# EAGLE design CMWC-Product (EAGLE 9.6.2)
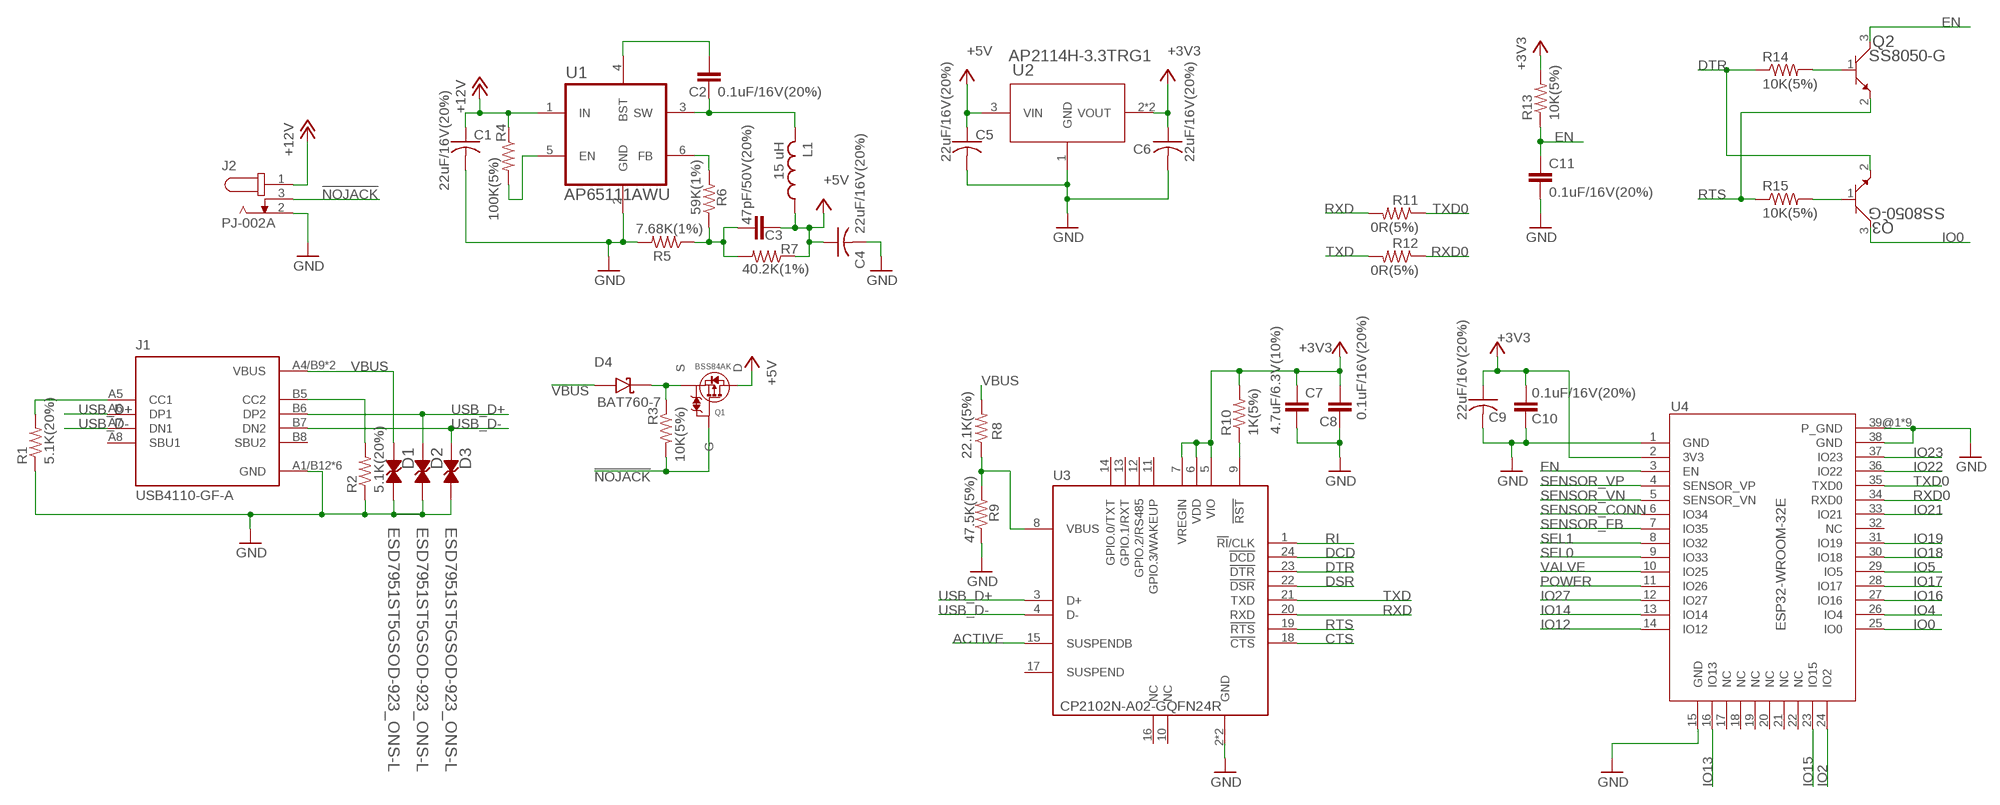
[diagram p0: schematic, sheet 1, part 1 of 2]
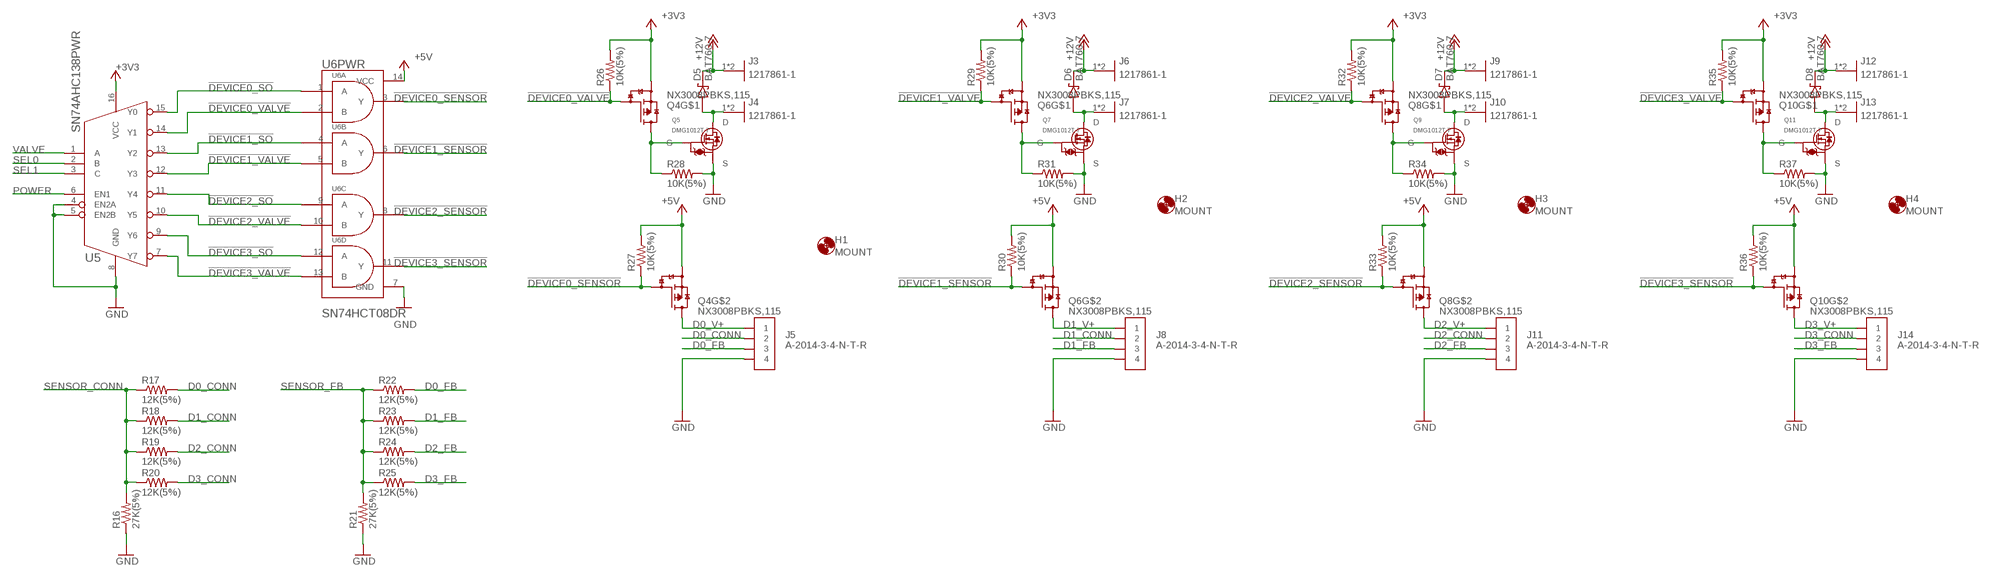
[diagram p1: schematic, sheet 1, part 2 of 2]

## Parts
C1  22uF/16V(20%)  C-USC1206  [C1206]
C2  0.1uF/16V(20%)  C-EUC0603  [C0603]
C3  47pF/50V(20%)  C-EUC0603  [C0603]
C4  22uF/16V(20%)  C-USC1206  [C1206]
C5  22uF/16V(20%)  C-USC1206  [C1206]
C6  22uF/16V(20%)  C-USC1206  [C1206]
C7  4.7uF/6.3V(10%)  C-EUC0603  [C0603]
C8  0.1uF/16V(20%)  C-EUC0603  [C0603]
C9  22uF/16V(20%)  C-USC1206  [C1206]
C10  0.1uF/16V(20%)  C-EUC0603  [C0603]
C11  0.1uF/16V(20%)  C-EUC0603  [C0603]
D1  ESD7951ST5GSOD-923_ONS-L  [SOD-923_ONS-L]
D2  ESD7951ST5GSOD-923_ONS-L  [SOD-923_ONS-L]
D3  ESD7951ST5GSOD-923_ONS-L  [SOD-923_ONS-L]
D4  BAT760-7  [SOD2513X120N]
D5  BAT760-7  [SOD2513X120N]
D6  BAT760-7  [SOD2513X120N]
D7  BAT760-7  [SOD2513X120N]
D8  BAT760-7  [SOD2513X120N]
H1  MOUNT  [#6-MOUNT]
H2  MOUNT  [#6-MOUNT]
H3  MOUNT  [#6-MOUNT]
H4  MOUNT  [#6-MOUNT]
J1  USB4110-GF-A  [GCT_USB4110-GF-A]
J2  PJ-002A  [CUI_PJ-002A]
J3  1217861-1  [TE_1217861-1]
J4  1217861-1  [TE_1217861-1]
J5  A-2014-3-4-N-T-R  [A-2014-3-4-N-T-R]
J6  1217861-1  [TE_1217861-1]
J7  1217861-1  [TE_1217861-1]
J8  A-2014-3-4-N-T-R  [A-2014-3-4-N-T-R]
J9  1217861-1  [TE_1217861-1]
J10  1217861-1  [TE_1217861-1]
J11  A-2014-3-4-N-T-R  [A-2014-3-4-N-T-R]
J12  1217861-1  [TE_1217861-1]
J13  1217861-1  [TE_1217861-1]
J14  A-2014-3-4-N-T-R  [A-2014-3-4-N-T-R]
L1  15 uH  BWVS00505040150M00  [BWVS00505040]
Q1  BSS84AK  [TO236]
Q2  SS8050-G  [TRAN_SS8050-G_CIP]
Q3  SS8050-G  [TRAN_SS8050-G_CIP]
Q4  NX3008PBKS,115  [SOT65P210X110-6N]
Q5  DMG1012T-7  [SOT523]
Q6  NX3008PBKS,115  [SOT65P210X110-6N]
Q7  DMG1012T-7  [SOT523]
Q8  NX3008PBKS,115  [SOT65P210X110-6N]
Q9  DMG1012T-7  [SOT523]
Q10  NX3008PBKS,115  [SOT65P210X110-6N]
Q11  DMG1012T-7  [SOT523]
R1  5.1K(20%)  R-US_R0603  [R0603]
R2  5.1K(20%)  R-US_R0603  [R0603]
R3  10K(5%)  R-US_R0603  [R0603]
R4  100K(5%)  R-US_R0603  [R0603]
R5  7.68K(1%)  R-US_R0603  [R0603]
R6  59K(1%)  R-US_R0603  [R0603]
R7  40.2K(1%)  R-US_R0603  [R0603]
R8  22.1K(5%)  R-US_R0603  [R0603]
R9  47.5K(5%)  R-US_R0603  [R0603]
R10  1K(5%)  R-US_R0603  [R0603]
R11  0R(5%)  R-US_R0603  [R0603]
R12  0R(5%)  R-US_R0603  [R0603]
R13  10K(5%)  R-US_R0603  [R0603]
R14  10K(5%)  R-US_R0603  [R0603]
R15  10K(5%)  R-US_R0603  [R0603]
R16  27K(5%)  R-US_R0603  [R0603]
R17  12K(5%)  R-US_R0603  [R0603]
R18  12K(5%)  R-US_R0603  [R0603]
R19  12K(5%)  R-US_R0603  [R0603]
R20  12K(5%)  R-US_R0603  [R0603]
R21  27K(5%)  R-US_R0603  [R0603]
R22  12K(5%)  R-US_R0603  [R0603]
R23  12K(5%)  R-US_R0603  [R0603]
R24  12K(5%)  R-US_R0603  [R0603]
R25  12K(5%)  R-US_R0603  [R0603]
R26  10K(5%)  R-US_R0603  [R0603]
R27  10K(5%)  R-US_R0603  [R0603]
R28  10K(5%)  R-US_R0603  [R0603]
R29  10K(5%)  R-US_R0603  [R0603]
R30  10K(5%)  R-US_R0603  [R0603]
R31  10K(5%)  R-US_R0603  [R0603]
R32  10K(5%)  R-US_R0603  [R0603]
R33  10K(5%)  R-US_R0603  [R0603]
R34  10K(5%)  R-US_R0603  [R0603]
R35  10K(5%)  R-US_R0603  [R0603]
R36  10K(5%)  R-US_R0603  [R0603]
R37  10K(5%)  R-US_R0603  [R0603]
U1  AP65111AWU  AP65111AWU-7  [SOT95P280X100-6N]
U2  AP2114H-3.3TRG1  [SOT-223_DIO]
U3  CP2102N-A02-GQFN24R  [QFN50P400X400X80-25N]
U4  ESP32-WROOM-32E  [ESP32-WROOM-32E]
U5  SN74AHC138PWR  [SOP65P640X120-16N]
U6  SN74HCT08DR  [SOIC127P600X175-14N]

## Nets
!DEVICE0_SENSOR: Q4.5(G2) R27.1 U6.3(A:Y)
!DEVICE0_SO: U5.15(Y0) U6.1(A:A)
!DEVICE0_VALVE: Q4.2(G1) R26.1 U5.14(Y1) U6.2(A:B)
!DEVICE1_SENSOR: Q6.5(G2) R30.1 U6.6(B:Y)
!DEVICE1_SO: U5.13(Y2) U6.4(B:A)
!DEVICE1_VALVE: Q6.2(G1) R29.1 U5.12(Y3) U6.5(B:B)
!DEVICE2_SENSOR: Q8.5(G2) R33.1 U6.8(C:Y)
!DEVICE2_SO: U5.11(Y4) U6.9(C:A)
!DEVICE2_VALVE: Q8.2(G1) R32.1 U5.10(Y5) U6.10(C:B)
!DEVICE3_SENSOR: Q10.5(G2) R36.1 U6.11(D:Y)
!DEVICE3_SO: U5.9(Y6) U6.12(D:A)
!DEVICE3_VALVE: Q10.2(G1) R35.1 U5.7(Y7) U6.13(D:B)
!NOJACK: J2.3 Q1.G R3.2
+3V3: C6.1 C7.1 C8.1 C9.1 C10.1 Q4.1(S1) Q6.1(S1) Q8.1(S1) Q10.1(S1) R10.2 R13.2 R26.2 R29.2 R32.2 R35.2 U2.2(VOUT) U2.4(VOUT) U3.5(VIO) U3.6(VDD) U3.7(VREGIN) U4.2(3V3) U5.16(VCC)
+5V: C3.2 C4.1 C5.1 L1.P$1 Q1.D Q4.4(S2) Q6.4(S2) Q8.4(S2) Q10.4(S2) R7.1 R27.2 R30.2 R33.2 R36.2 U2.3(VIN) U6.14(PWR:VCC)
+12V: C1.1 D5.C D6.C D7.C D8.C J2.1 J3.1 J3.2 J6.1 J6.2 J9.1 J9.2 J12.1 J12.2 R4.1 U1.1(IN)
ACTIVE: U3.15(SUSPENDB)
BUCK_BST: C2.1 U1.4(BST)
BUCK_EN: R4.2 U1.5(EN)
BUCK_FB: R6.2 U1.6(FB)
BUCK_SW: C2.2 L1.P$2 U1.3(SW)
CTS: U3.18(!CTS)
D0_CONN: J5.2 R17.2
D0_FB: J5.3 R22.2
D0_V+: J5.1 Q4.3(D2)
D1_CONN: J8.2 R18.2
D1_FB: J8.3 R23.2
D1_V+: J8.1 Q6.3(D2)
D2_CONN: J11.2 R19.2
D2_FB: J11.3 R24.2
D2_V+: J11.1 Q8.3(D2)
D3_CONN: J14.2 R20.2
D3_FB: J14.3 R25.2
D3_V+: J14.1 Q10.3(D2)
DCD: U3.24(!DCD)
DSR: U3.22(!DSR)
DTR: Q3.2 R14.1 U3.23(!DTR)
EN: C11.1 Q2.3 R13.1 U4.3(EN)
GND: C1.2 C4.2 C5.2 C6.2 C7.2 C8.2 C9.2 C10.2 C11.2 D1.1(CATHODE) D2.1(CATHODE) D3.1(CATHODE) J1.A1/B12(GND) J1.B1/A12(GND) J1.S1(GND) J1.S2(GND) J1.S3(GND) J1.S4(GND) J2.2 J5.4 J8.4 J11.4 J14.4 Q5.1(S) Q7.1(S) Q9.1(S) Q11.1(S) R1.1 R2.1 R5.2 R9.1 R16.1 R21.1 R28.2 R31.2 R34.2 R37.2 U1.2(GND) U2.1(GND) U3.2(GND) U3.25(GND) U4.1(GND) U4.15(GND) U4.38(GND) U4.39@1(P_GND) U4.39@2(P_GND) U4.39@3(P_GND) U4.39@4(P_GND) U4.39@5(P_GND) U4.39@6(P_GND) U4.39@7(P_GND) U4.39@8(P_GND) U4.39@9(P_GND) U5.4(EN2A) U5.5(EN2B) U5.8(GND) U6.7(PWR:GND)
IO0: Q3.3 U4.25(IO0)
IO2: U4.24(IO2)
IO4: U4.26(IO4)
IO5: U4.29(IO5)
IO12: U4.14(IO12)
IO13: U4.16(IO13)
IO14: U4.13(IO14)
IO15: U4.23(IO15)
IO16: U4.27(IO16)
IO17: U4.28(IO17)
IO18: U4.30(IO18)
IO19: U4.31(IO19)
IO21: U4.33(IO21)
IO22: U4.36(IO22)
IO23: U4.37(IO23)
IO27: U4.12(IO27)
N$3: D4.C Q1.S R3.1
N$4: C3.1 R5.1 R6.1 R7.2
N$7: J1.A5(CC1) R1.2
N$8: J1.B5(CC2) R2.2
N$9: R8.1 R9.2 U3.8(VBUS)
N$10: D5.A J4.1 J4.2 Q5.3(D)
N$11: Q2.1 R14.2
N$12: Q3.1 R15.2
N$13: R10.1 U3.9(!RST)
N$14: Q4.6(D1) Q5.2(G) R28.1
N$15: D6.A J7.1 J7.2 Q7.3(D)
N$16: Q6.6(D1) Q7.2(G) R31.1
N$17: D7.A J10.1 J10.2 Q9.3(D)
N$18: Q8.6(D1) Q9.2(G) R34.1
N$19: D8.A J13.1 J13.2 Q11.3(D)
N$20: Q10.6(D1) Q11.2(G) R37.1
POWER: U4.11(IO26) U5.6(EN1)
RI: U3.1(!RI!/CLK)
RTS: Q2.2 R15.1 U3.19(!RTS)
RXD: R11.2 U3.20(RXD)
RXD0: R12.1 U4.34(RXD0)
SEL0: U4.9(IO33) U5.2(B)
SEL1: U4.8(IO32) U5.3(C)
SENSOR_CONN: R16.2 R17.1 R18.1 R19.1 R20.1 U4.6(IO34)
SENSOR_FB: R21.2 R22.1 R23.1 R24.1 R25.1 U4.7(IO35)
SENSOR_VN: U4.5(SENSOR_VN)
SENSOR_VP: U4.4(SENSOR_VP)
TXD: R12.2 U3.21(TXD)
TXD0: R11.1 U4.35(TXD0)
USB_D+: D2.2(ANODE) J1.A6(DP1) J1.B6(DP2) U3.3(D+)
USB_D-: D3.2(ANODE) J1.A7(DN1) J1.B7(DN2) U3.4(D-)
VALVE: U4.10(IO25) U5.1(A)
VBUS: D1.2(ANODE) D4.A J1.A4/B9(VBUS) J1.B4/A9(VBUS) R8.2
Unconnected: J1.A8(SBU1) J1.B8(SBU2) U3.10(NC) U3.11(GPIO.3/WAKEUP) U3.12(GPIO.2/RS485) U3.13(GPIO.1/RXT) U3.14(GPIO.0/TXT) U3.16(NC) U3.17(SUSPEND) U4.17(NC) U4.18(NC) U4.19(NC) U4.20(NC) U4.21(NC) U4.22(NC) U4.32(NC)

## Library data of the parts
C1 C4-C6 C9 = rcl:C-US: CAPACITOR, American symbol; DIGI-KEY_PART_NUMBER: 1276-2728-1-ND; SPICEPREFIX: C
C2 C3 C8 C10 C11 = rcl:C-EU: CAPACITOR, European symbol; DIGI-KEY_PART_NUMBER: 399-1099-1-ND; SPICEPREFIX: C
C7 = rcl:C-EU: CAPACITOR, European symbol; DIGI-KEY_PART_NUMBER: 1276-1045-1-ND; SPICEPREFIX: C
D1-D3 = CMWC-Product:ESD7951ST5G; BUILT_BY: EMA_Jessica; COPYRIGHT: Copyright (C) 2018 Accelerated Designs. All rights reserved; DIGI-KEY_PART_NUMBER: ESD7951ST5GOSCT-ND; MANUFACTURER_PART_NUMBER: ESD7951ST5G; SOURCELIBRARY: ON_Semiconductor_2019-12-30; VENDOR: ON Semiconductor
D4-D8 = CMWC-Product:BAT760-7: Diode Schottky 30V 1A Surface Mount SOD-323; DIGI-KEY_PART_NUMBER: BAT760DICT-ND; MF: Diodes Inc.; MP: BAT760-7; PACKAGE: SOD-323 Diodes Inc.; PURCHASE-URL: https://pricing.snapeda.com/search/part/BAT760-7/?ref=eda
H1-H4 = CMWC-Product:MOUNT
J1 = CMWC-Product:USB4110-GF-A: CONN USB 2.0 TYPE-C R/A SMT / USB-C (USB TYPE-C) USB 2.0 Receptacle Connector 24 (16+8 Dummy) Position Surface Mount / Right Angle Through Hole; DIGI-KEY_PART_NUMBER: 2073-USB4110-GF-A-1-ND; MF: GCT; MP: USB4110-GF-A; PACKAGE: None; PURCHASE-URL: https://pricing.snapeda.com/search/part/USB4110-GF-A/?ref=eda
J2 = CMWC-Product:PJ-002A: 2.0 mm Center Pin, 2.5 A, Right Angle, Through Hole, Dc Power Jack Connector; AVAILABILITY: Good; CUI_PURCHASE_URL: https://www.cuidevices.com/product/interconnect/connectors/dc-power-connectors/jacks/pj-002a?utm_source=snapeda.com&utm_medium=referral&utm_campaign=snapedaBOM; DIGI-KEY_PART_NUMBER: CP-002A-ND; MF: CUI Devices; MP: PJ-002A; PACKAGE: None; PRICE: None; PURCHASE-URL: https://pricing.snapeda.com/search/part/PJ-002A/?ref=eda
J3 J4 J6 J7 J9 J10 J12 J13 = CMWC-Product:1217861-1: FASTON 250 PCB TAB TPBR / Solder Tab Terminal / Uninsulated / Tin over Copper Plated / Straight / 6.35x0.83mm; AVAILABILITY: Unavailable; COMMENT: 1217861-1; DIGI-KEY_PART_NUMBER: A100452CT-ND; MF: TE Connectivity; MP: 1217861-1; PACKAGE: None; PRICE: None; TE_PURCHASE_URL: https://www.te.com/usa-en/product-1217861-1.html?te_bu=Cor&te_type=disp&te_campaign=seda_glo_cor-seda-global-disp-prtnr-fy19-seda-model-bom-cta_sma-317_1&elqCampaignId=32493
J5 J8 J11 J14 = CMWC-Product:A-2014-3-4-N-T-R: Vertical 4p4c Modular Connector (Unshielded); DIGI-KEY_PART_NUMBER: AE10393-ND
L1 = CMWC-Product:BWVS00505040150M00; DIGI-KEY_PART_NUMBER: 2184-BWVS00505040150M00CT-ND
Q1 = CMWC-Product:BSS84AK; DIGI-KEY_PART_NUMBER: 1727-1144-1-ND
Q2 Q3 = CMWC-Product:SS8050-G; BUILT_BY: EMA_Kyle; COPYRIGHT: Copyright (C) 2018 Accelerated Designs. All rights reserved; DIGI-KEY_PART_NUMBER: 641-1790-1-ND; MANUFACTURER_PART_NUMBER: SS8050-G; SOURCELIBRARY: Comchip_2020-02-14; VENDOR: Comchip
Q4 Q6 Q8 Q10 = CMWC-Product:NX3008PBKS,115: Mosfet Array 2 P-Channel (Dual) / 30V 200mA 445mW / Surface Mount 6-TSSOP; DIGI-KEY_PART_NUMBER: 1727-1282-1-ND; MF: Nexperia USA; MP: NX3008PBKS,115; PACKAGE: TSSOP6-6 Nexperia USA Inc.; PURCHASE-URL: https://pricing.snapeda.com/search/part/NX3008PBKS,115/?ref=eda
Q5 Q7 Q9 Q11 = CMWC-Product:DMG1012T-7: N-Channel Enhancement Mode MOSFET - 0.63A (Ta); DIGI-KEY_PART_NUMBER: DMG1012T-7DICT-ND
R1 R2 = rcl:R-US_: RESISTOR, American symbol; DIGI-KEY_PART_NUMBER: RR08P5.1KDCT-ND; SPICEPREFIX: R
R3 R13-R15 R26-R37 = rcl:R-US_: RESISTOR, American symbol; DIGI-KEY_PART_NUMBER: RNCP0603FTD10K0CT-ND; SPICEPREFIX: R
R4 = rcl:R-US_: RESISTOR, American symbol; DIGI-KEY_PART_NUMBER: RR08P100KDCT-ND; SPICEPREFIX: R
R5 = rcl:R-US_: RESISTOR, American symbol; DIGI-KEY_PART_NUMBER: 541-768HCT-ND; SPICEPREFIX: R
R6 = rcl:R-US_: RESISTOR, American symbol; DIGI-KEY_PART_NUMBER: RMCF0603FT59K0CT-ND; SPICEPREFIX: R
R7 = rcl:R-US_: RESISTOR, American symbol; DIGI-KEY_PART_NUMBER: CR0603-FX-4022ELFCT-ND; SPICEPREFIX: R
R8 = rcl:R-US_: RESISTOR, American symbol; DIGI-KEY_PART_NUMBER: RR08P22.1KDCT-ND; SPICEPREFIX: R
R9 = rcl:R-US_: RESISTOR, American symbol; DIGI-KEY_PART_NUMBER: RR08P47.5KDCT-ND; SPICEPREFIX: R
R10 = rcl:R-US_: RESISTOR, American symbol; DIGI-KEY_PART_NUMBER: RR08P1.0KDCT-ND; SPICEPREFIX: R
R11 R12 = rcl:R-US_: RESISTOR, American symbol; DIGI-KEY_PART_NUMBER: CR0603-J/-000ELFCT-ND; SPICEPREFIX: R
R16 R21 = rcl:R-US_: RESISTOR, American symbol; DIGI-KEY_PART_NUMBER: 541-27.0KHCT-ND; SPICEPREFIX: R
R17-R20 R22-R25 = rcl:R-US_: RESISTOR, American symbol; DIGI-KEY_PART_NUMBER: 311-2415-1-ND; SPICEPREFIX: R
U1 = CMWC-Product:AP65111AWU-7: Buck Switching Regulator IC Positive Adjustable 0.8V / 1 Output 1.5A / SOT-23-6 Thin / TSOT-23-6; DIGI-KEY_PART_NUMBER: AP65111AWU-7DICT-ND; MF: Diodes Inc.; MP: AP65111AWU-7; PACKAGE: TSOT-23-6 Diodes Inc.
U2 = CMWC-Product:AP2114H-3.3TRG1; BUILT_BY: EMA_UL_Team; DIGI-KEY_PART_NUMBER: AP2114H-3.3TRG1DICT-ND; MANUFACTURER_PART_NUMBER: AP2114H-3.3TRG1; SOURCELIBRARY: DIODESINC_2_2015-08-18; VENDOR: Diodes Inc
U3 = CMWC-Product:CP2102N-A02-GQFN24R: USB Bridge / USB to UART USB 2.0 UART Interface 24-QFN (4x4); DIGI-KEY_PART_NUMBER: 336-5888-1-ND; MF: Silicon Labs; MP: CP2102N-A02-GQFN24R; PACKAGE: WFQFN-24 Silicon Labs; PURCHASE-URL: https://pricing.snapeda.com/search/part/CP2102N-A02-GQFN24R/?ref=eda
U4 = CMWC-Product:ESP32-WROOM-32E: Espressif ESP32 Based RF Microcontroller; DIGI-KEY_PART_NUMBER: 1965-ESP32-WROOM-32E(4MB)CT-ND
U5 = CMWC-Product:SN74AHC138PWR: 3-Line To 8-Line Decoder / Demultiplexer 16-TSSOP -40 to 85; AVAILABILITY: Good; DIGI-KEY_PART_NUMBER: 296-1084-1-ND; MF: Texas Instruments; MP: SN74AHC138PWR; PACKAGE: TSSOP-16 Texas Instruments; PRICE: None; PURCHASE-URL: https://pricing.snapeda.com/search/part/SN74AHC138PWR/?ref=eda
U6 = CMWC-Product:SN74HCT08DR: Quadruple 2-Input Positive-AND Gates 14-SOIC -40 to 85; DIGI-KEY_PART_NUMBER: 296-14862-1-ND; MF: Texas Instruments; MP: SN74HCT08DR; PACKAGE: SOIC-14 Texas Instruments; PURCHASE-URL: https://pricing.snapeda.com/search/part/SN74HCT08DR/?ref=eda

## Board
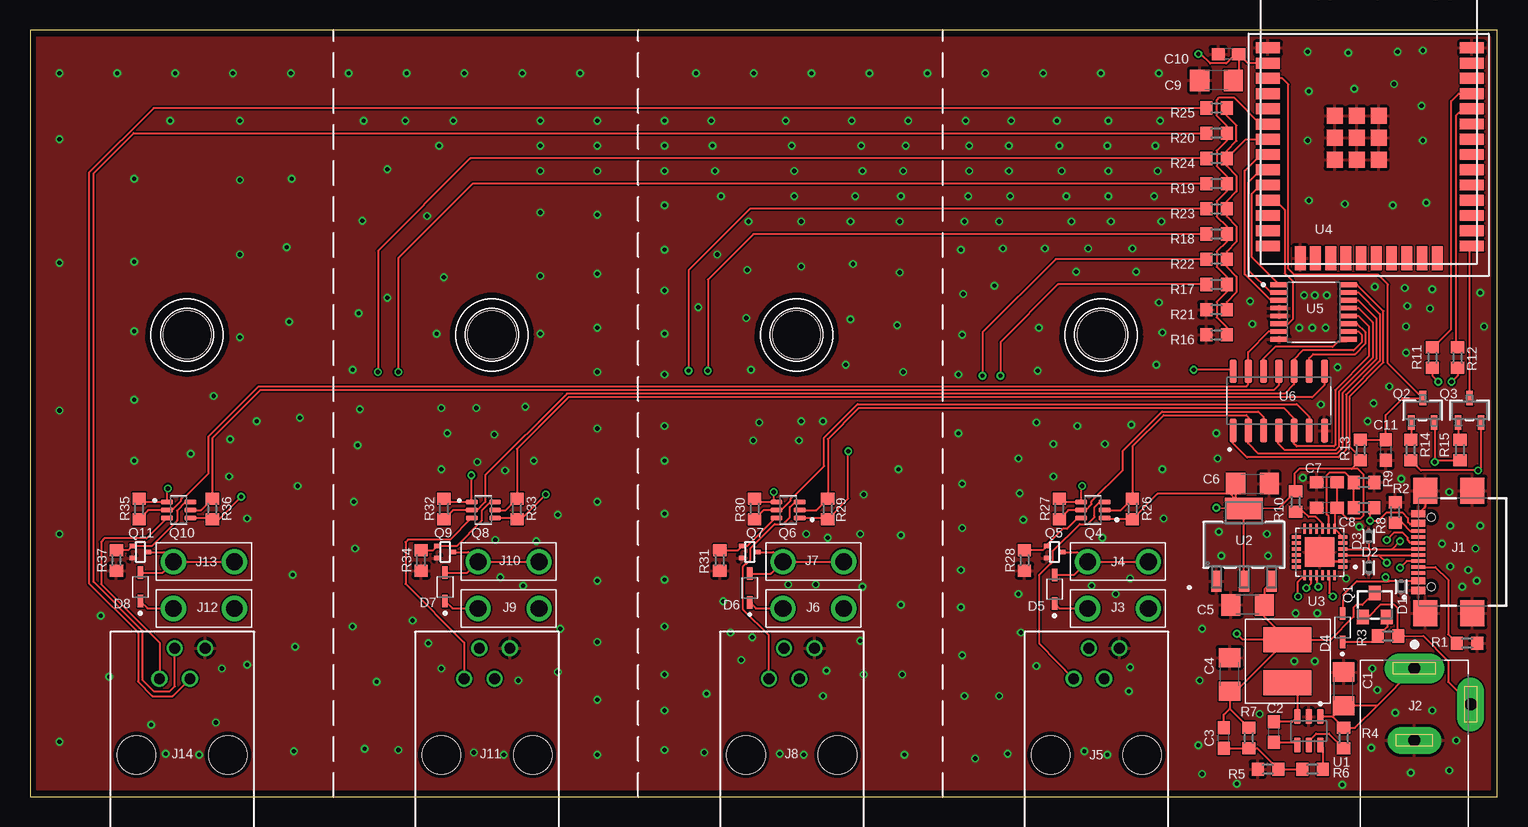
[diagram p2: board, top side]
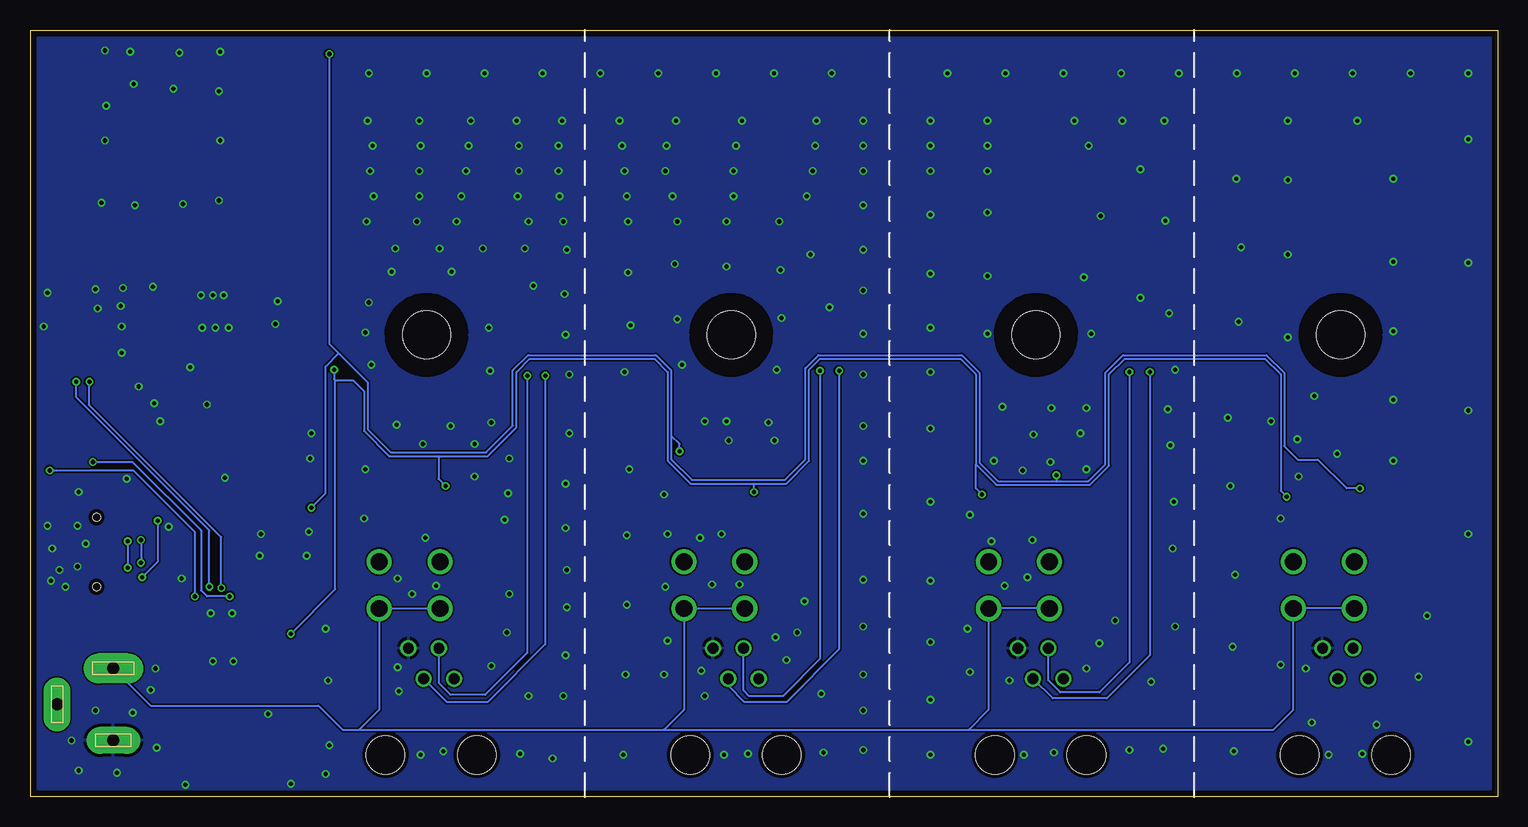
[diagram p3: board, bottom side, seen from below]

Size 122.3 x 63.9 mm. Coordinates in mm from the lower left corner, seen from the top.
Outline: 0,0 122.3,0 122.3,63.9 0,63.9 0,0
Copper layers (1*16): Top 0.035mm / dielectric 1.5mm / Bottom 0.035mm
Design rules "default *": minimum track width 5mil, minimum drill 0.2mm, track to track 5mil, track to pad 0.2mm, pad to pad 5mil, via to via 10mil, smd to smd 0mil, copper to edge 0.33mm, drill to drill 0.54mm, minimum pad ring 0.15mm, minimum via ring 0.15mm, stop-mask expansion 0.05mm, vias tented up to drill 0mil, thermal gap 10mil

### Footprints (pad centres in the part's own frame; a part is rotated, then mirrored left to right if it is on the bottom)
C1206 = smd 1.6 x 1.8: 1 -1.4,0; 2 1.4,0
C0603 = smd 1.1 x 1: 1 -0.85,0; 2 0.85,0
SOD-923_ONS-L = smd 0.279 x 0.203: 1 -0.483,0; 2 0.483,0
SOD2513X120N = smd 1.04 x 0.46: A 1.19,0; C -1.19,0
#6-MOUNT = hole 4: 0,0
GCT_USB4110-GF-A = smd 0.6 x 1.15: A1/B12 -3.2,1.075; A4/B9 -2.4,1.075; B1/A12 3.2,1.075; B4/A9 2.4,1.075 | smd 0.3 x 1.15: A5 -1.25,1.075; A6 -0.25,1.075; A7 0.25,1.075; A8 1.25,1.075; B5 1.75,1.075; B6 0.75,1.075; B7 -0.75,1.075; B8 -1.75,1.075 | smd 2.18 x 2: S1 -5.11,0.5; S2 5.11,0.5; S3 -5.11,-3.43; S4 5.11,-3.43 | hole 0.65: -2.89,0; 2.89,0
CUI_PJ-002A = drill 1 pad 2.5 long: 1 0,0 | drill 1 pad 2.25 long: 2 6,0; 3 3,4.7
TE_1217861-1 = drill 1.4: 1 -2.54,0; 2 2.54,0
A-2014-3-4-N-T-R = drill 0.9: 1 1.905,-6.35; 2 0.635,-8.89; 3 -0.635,-6.35; 4 -1.905,-8.89 | hole 3.2: -3.81,0; 3.81,0
BWVS00505040 = smd 4 x 2.1: P$1 0,1.8; P$2 0,-1.8
TO236 = smd 1 x 1.2: D 0,1; G -1,-1; S 1,-1
TRAN_SS8050-G_CIP = smd 0.559 x 1.219: 1 -0.95,-1.021; 2 0.95,-1.021; 3 0,1.021
SOT65P210X110-6N = smd 0.99 x 0.41: 1 -0.97,0.65; 2 -0.97,0; 3 -0.97,-0.65; 4 0.97,-0.65; 5 0.97,0; 6 0.97,0.65
SOT523 = smd 0.4 x 0.51: 1 0.5,-0.645; 2 -0.5,-0.645; 3 0,0.645
R0603 = smd 1 x 1.1: 1 -0.85,0; 2 0.85,0
SOT95P280X100-6N = smd 1.24 x 0.55: 1 -1.185,0.95; 2 -1.185,0; 3 -1.185,-0.95; 4 1.185,-0.95; 5 1.185,0; 6 1.185,0.95
SOT-223_DIO = smd 0.851 x 1.761: 1 -2.3,-3.025; 2 0,-3.025; 3 2.3,-3.025 | smd 3.151 x 1.761: 4 0,3.025
QFN50P400X400X80-25N = smd 0.84 x 0.26: 1 -1.935,1.25; 2 -1.935,0.75; 3 -1.935,0.25; 4 -1.935,-0.25; 5 -1.935,-0.75; 6 -1.935,-1.25; 13 1.935,-1.25; 14 1.935,-0.75; 15 1.935,-0.25; 16 1.935,0.25; 17 1.935,0.75; 18 1.935,1.25 | smd 0.26 x 0.84: 7 -1.25,-1.935; 8 -0.75,-1.935; 9 -0.25,-1.935; 10 0.25,-1.935; 11 0.75,-1.935; 12 1.25,-1.935; 19 1.25,1.935; 20 0.75,1.935; 21 0.25,1.935; 22 -0.25,1.935; 23 -0.75,1.935; 24 -1.25,1.935 | smd 2.45 x 2.45: 25 0,0
ESP32-WROOM-32E = smd 2 x 0.9: 1 0.6,18.01; 2 0.6,16.74; 3 0.6,15.47; 4 0.6,14.2; 5 0.6,12.93; 6 0.6,11.64; 7 0.6,10.39; 8 0.6,9.12; 9 0.6,7.85; 10 0.6,6.58; 11 0.6,5.31; 12 0.6,4.04; 13 0.6,2.77; 14 0.6,1.5; 25 17.6,1.5; 26 17.6,2.77; 27 17.6,4.04; 28 17.6,5.31; 29 17.6,6.58; 30 17.6,7.85; 31 17.6,9.12; 32 17.6,10.39; 33 17.6,11.66; 34 17.6,12.93; 35 17.6,14.2; 36 17.6,15.47; 37 17.6,16.74; 38 17.6,18.01 | smd 0.9 x 2: 15 3.285,0.5; 16 4.555,0.5; 17 5.825,0.5; 18 7.095,0.5; 19 8.365,0.5; 20 9.635,0.5; 21 10.905,0.5; 22 12.175,0.5; 23 13.445,0.5; 24 14.715,0.5 | smd 1.33 x 1.33: 39@1 8,10.51; 39@2 6.165,10.51; 39@3 9.835,10.51; 39@4 8,12.345; 39@5 6.165,12.345; 39@6 9.835,12.345; 39@7 8,8.675; 39@8 6.165,8.675; 39@9 9.835,8.675
SOP65P640X120-16N = smd 1.57 x 0.41: 1 -2.87,2.275; 2 -2.87,1.625; 3 -2.87,0.975; 4 -2.87,0.325; 5 -2.87,-0.325; 6 -2.87,-0.975; 7 -2.87,-1.625; 8 -2.87,-2.275; 9 2.87,-2.275; 10 2.87,-1.625; 11 2.87,-0.975; 12 2.87,-0.325; 13 2.87,0.325; 14 2.87,0.975; 15 2.87,1.625; 16 2.87,2.275
SOIC127P600X175-14N = smd 1.97 x 0.6: 1 -2.475,3.81; 2 -2.475,2.54; 3 -2.475,1.27; 4 -2.475,0; 5 -2.475,-1.27; 6 -2.475,-2.54; 7 -2.475,-3.81; 8 2.475,-3.81; 9 2.475,-2.54; 10 2.475,-1.27; 11 2.475,0; 12 2.475,1.27; 13 2.475,2.54; 14 2.475,3.81

### Placement (x,y rotation side)
C1  109.5,9 90 top
C2  103.7,5.4 90 top
C3  99.5,4.9 90 top
C4  100,10.2 90 top
C5  101.5,16 180 top
C6  101.9,26.1 0 top
C7  108.1,26.2 180 top
C8  108.1,24.1 180 top
C9  98.9,59.7 180 top
C10  99.9,61.9 180 top
C11  113,28.9 270 top
D1  114.3,17.5 90 top
D2  111.6,19.1 90 top
D3  111.6,21.7 270 top
D4  109.4,14.1 90 top
D5  85.4,17.3 90 top
D6  60,17.4 90 top
D7  34.6,17.5 90 top
D8  9.2,17.5 90 top
H1  89.3,38.5 0 top
H2  63.9,38.5 0 top
H3  38.5,38.5 0 top
H4  13.1,38.5 0 top
J1  116.8,20.4 90 top
J2  115.4,10.7 270 top
J3  90.7,15.7 180 top
J4  90.7,19.6 180 top
J5  88.9,3.5 180 top
J6  65.3,15.7 0 top
J7  65.3,19.6 0 top
J8  63.5,3.5 180 top
J9  39.9,15.7 0 top
J10  39.9,19.6 0 top
J11  38.1,3.5 180 top
J12  14.5,15.7 0 top
J13  14.5,19.6 0 top
J14  12.7,3.5 180 top
L1  104.8,11.3 0 top
Q1  112.1,16 0 top
Q2  116.1,32.2 0 top
Q3  120,32.2 0 top
Q4  88.6,23.9 180 top
Q5  85.4,20.4 270 top
Q6  63.2,23.9 180 top
Q7  60,20.4 270 top
Q8  37.8,23.9 0 top
Q9  34.6,20.4 270 top
Q10  12.4,23.9 0 top
Q11  9.2,20.4 270 top
R1  119.8,12.8 180 top
R2  113.8,23.7 270 top
R3  113.2,13.4 0 top
R4  109.5,4.9 270 top
R5  103.2,2.3 180 top
R6  106.9,2.3 0 top
R7  101.6,4.9 270 top
R8  111.2,24.1 0 top
R9  111.2,26.2 180 top
R10  105.5,24.6 90 top
R11  116.9,36.6 270 top
R12  119,36.6 270 top
R13  110.9,28.9 270 top
R14  115.1,28.9 90 top
R15  119.2,28.9 90 top
R16  98.9,38.5 0 top
R17  98.9,42.7 180 top
R18  98.9,46.9 180 top
R19  98.9,51.1 180 top
R20  98.9,55.3 180 top
R21  98.9,40.6 0 top
R22  98.9,44.8 180 top
R23  98.9,49 180 top
R24  98.9,53.2 180 top
R25  98.9,57.4 180 top
R26  91.9,24 270 top
R27  85.8,24 90 top
R28  82.9,19.7 270 top
R29  66.5,24 270 top
R30  60.4,24 90 top
R31  57.5,19.7 270 top
R32  34.5,24 90 top
R33  40.6,24 270 top
R34  32.6,19.7 270 top
R35  9.1,24 90 top
R36  15.2,24 270 top
R37  7.2,19.7 270 top
U1  106.6,5.5 270 top
U2  101.2,21 0 top
U3  107.5,20.4 180 top
U4  102.6,44.4 0 top
U5  107,40.4 0 top
U6  104.1,33 90 top

### Tracks (layer width: path | path; a pad name or v marks a point on that pad's centre or on a via)
!DEVICE0_SENSOR
  Top 0.152: R27.1 86.55,23.9 Q4.5 88.01,23.9 88.5,24.39 88.5,24.61 91.09,27.21 91.09,28.83 94.37,32.1 102.39,32.1 102.83,31.67 U6.3
!DEVICE0_SO
  Top 0.152: U5.15 110.72,42.03 112.53,40.23 112.53,36.33 109.71,33.52 109.71,28.92 109.08,28.29 101.45,28.29 100.26,29.48 100.26,30.5 U6.1
!DEVICE0_VALVE
  Top 0.152: U5.14 110.72,41.38 112.22,39.88 112.22,36.46 109.41,33.65 109.41,29.05 108.95,28.59 102.41,28.59 101.55,29.45 U6.2 101.56,31.64 101.4,31.8 94.5,31.8 91.9,29.2 R26.1 90.95,23.9 Q4.2
!DEVICE1_SENSOR
  Top 0.152: R30.1 61.15,23.9 Q6.5 62.61,23.9 63.4,24.69 63.4,24.81 63.62,25.03 63.67,25.03 66.19,27.55 66.19,29.93 68.98,32.71 105.59,32.71 106.64,31.66 U6.6
!DEVICE1_SO
  Top 0.152: U5.13 110.72,40.73 111.92,39.54 111.92,36.59 109.11,33.77 109.11,29.17 108.83,28.89 104.61,28.89 104.07,29.43 104.07,30.5 U6.4
!DEVICE1_VALVE
  Top 0.152: U5.12 110.72,40.09 111.61,39.2 111.61,36.71 108.8,33.9 108.8,29.3 108.7,29.2 105.6,29.2 105.37,29.43 U6.5 105.37,31.55 104.51,32.41 69.11,32.41 66.5,29.8 R29.1 65.55,23.9 Q6.2
!DEVICE2_SENSOR
  Top 0.152: Q8.5 39.65,23.9 R33.1 40.6,29 44.89,33.29 106.89,33.29 107.91,34.31 U6.8
!DEVICE2_SO
  Top 0.152: U5.11 110.62,39.44 111.31,38.75 111.31,37.74 110.46,36.89 106.98,36.89 106.64,36.55 U6.9
!DEVICE2_VALVE
  Top 0.152: U5.10 110.72,38.78 111,38.51 111,37.87 110.33,37.2 106.1,37.2 105.34,36.44 105.37,36.41 U6.10 105.37,34.37 104.59,33.59 44.76,33.59 37.95,26.78 37.95,24.57 37.28,23.9 Q8.2 35.25,23.9 R32.1
!DEVICE3_SENSOR
  Top 0.152: Q10.5 14.25,23.9 R36.1 15.2,29.9 19.2,33.9 103.69,33.9 104.1,34.3 U6.11
!DEVICE3_SO
  Top 0.152: U5.9 109.69,37.94 109.03,37.94 108.6,37.5 103.8,37.5 102.8,36.5 102.83,36.47 U6.12
!DEVICE3_VALVE
  Top 0.152: U5.7 103.28,38.78 101.56,37.06 U6.13 101.56,34.36 101.4,34.2 19.07,34.2 14.89,30.03 14.89,26.95 12.97,25.03 12.82,25.03 12.6,24.81 12.6,24.66 11.94,24 11.53,24 Q10.2 9.85,23.9 R35.1
!NOJACK
  Top 0.152: Q1.G 111.63,15.06 112.56,15.99 113.75,15.99 113.98,15.76 113.98,13.53 R3.2 116.13,13.41 118.23,11.31 118.23,9.57 J2.3
+3V3  (via drill 0.35)
  Top 0.152: C7.1 C8.1 | C8.1 108.75,23.9 U3.7 U3.6 U3.5 | 110.18,27.33 110.69,27.33 111.18,26.84 111.18,23.45 110.94,23.22 109.75,23.22 108.95,24.03 C8.1 | 110.18,27.33 105.81,27.33 105.4,26.92 105.4,25.55 R10.2 104.09,24.05 U2.4 | 110.18,27.33 R13.2 110.9,28.28 110.02,29.16 110.02,33.4 112.83,36.21 112.83,40.48 110.62,42.69 U5.16 | Q4.1 89.67,23.15 R26.2 94,25.25 100.08,25.25 U2.4 | U2.4 100.52,24.8 C6.1 | U2.2 U2.4 | Q6.1 66.4,23.25 R29.2 68.2,24.85 v68.2,28.8 | R32.2 34.8,24.55 Q8.1 36.83,26.77 v36.8,26.8 | R35.2 9.4,24.55 Q10.1 11.43,25.63 v11.5,25.7 | U2.4 98.95,24.05 v98.9,24.1 | C10.1 101.51,61.14 U4.2 | C10.1 100.49,61.9 99.71,61.12 98.39,61.12 97.61,61.9 v97.4,61.9 | C10.1 100.75,60.15 C9.1
  Bottom 0.152: 96.61,36.95 97.71,35.85 97.71,25.29 v98.9,24.1 | v97.4,61.9 97.4,37.74 96.61,36.95 | 96.61,36.95 94.19,34.54 94.19,30.63 92.27,28.7 84.33,28.7 82.11,30.93 82.11,35.53 80.83,36.8 70.17,36.8 68.89,35.53 68.89,30.1 | 68.89,30.1 68.89,28.13 67.17,26.41 59.43,26.41 57.7,28.13 57.7,35.73 56.63,36.8 44.67,36.8 43.2,35.33 43.2,27.83 41.67,26.3 36.8,26.3 | 36.8,26.3 34.13,26.3 32.7,27.73 32.7,35.33 31.23,36.8 19.27,36.8 17.8,35.33 17.8,29.23 16.67,28.11 15,28.11 12.6,25.7 v11.5,25.7 | v36.8,26.8 36.8,26.3 | v68.2,28.8 68.2,29.41 68.89,30.1
+5V  (via drill 0.35)
  Top 0.152: R27.2 86.1,24.55 Q4.4 87.63,25.83 v87.7,25.9 | U2.3 102.9,17.32 C5.1 102.9,15 L1.P$1 | R30.2 60.7,24.55 Q6.4 62,24.78 v62,25.4 | Q8.4 40.5,23.25 R33.2 40.95,23.15 v43,25.2 | Q10.4 15.1,23.25 R36.2 15.75,23.15 v17.6,25 | v100.6,13.6 101.1,13.1 L1.P$1 | Q1.D 111.08,15.99 110.56,15.99 110.32,15.75 110.32,14.99 108.42,13.1 L1.P$1 | U6.14 100.17,35.6 v97,35.6 | 100,7.35 C4.1 100.5,8.8 L1.P$1 | 100,7.35 R7.1 | C3.2 99.5,6.85 100,7.35
  Bottom 0.152: v100.6,13.6 96.9,17.3 96.9,34.7 | 96.9,34.7 95.4,34.7 94.5,33.8 94.5,30.5 92.4,28.4 88.3,28.4 | 88.3,28.4 84.2,28.4 81.8,30.8 81.8,35.4 80.7,36.5 70.3,36.5 69.2,35.4 69.2,28 67.3,26.1 62,26.1 | 62,26.1 59.3,26.1 57.4,28 57.4,35.6 56.5,36.5 44.8,36.5 43.5,35.2 43.5,27.7 | 43.5,27.7 41.8,26 34,26 32.4,27.6 32.4,35.2 31.1,36.5 19.4,36.5 18.1,35.2 18.1,25.5 v17.6,25 | v97,35.6 97,34.8 96.9,34.7 | v43,25.2 43.5,25.7 43.5,27.7 | v62,25.4 62,26.1 | 88.3,28.4 88.3,26.5 v87.7,25.9
+12V
  Top 0.152: D5.C 85.81,15.7 J3.2 | D6.C 60.51,15.7 J6.1 | D7.C 35.21,15.7 J9.1 | D8.C 9.81,15.7 J12.1 | 108.58,6.68 C1.1 112.3,7.6 | 108.58,6.68 U1.1 | 108.58,6.68 108.58,6.67 R4.1 110.45,5.75 112.3,7.6 | J2.1 112.3,7.6
  Bottom 0.152: 94.9,5.6 96.3,5.6 98.3,7.6 112.3,7.6 J2.1 | 94.9,5.6 69.5,5.6 | 69.5,5.6 67.84,7.26 J6.2 J6.1 | 69.5,5.6 44.1,5.6 | 44.1,5.6 18.7,5.6 17.04,7.26 J12.2 J12.1 | 44.1,5.6 42.44,7.26 J9.2 J9.1 | 94.9,5.6 93.24,7.26 J3.1 J3.2
BUCK_BST
  Top 0.152: C2.1 105.42,4.55 U1.4
BUCK_EN
  Top 0.152: U1.5 106.6,4.64 107.22,5.26 108.29,5.26 R4.2
BUCK_FB
  Top 0.152: U1.6 107.75,4.12 R6.2
BUCK_SW
  Top 0.152: C2.2 105.22,6.25 U1.3 105.65,8.65 L1.P$2
D0_CONN  (via drill 0.35)
  Top 0.152: R17.2 85.7,42.7 80.9,37.9 v80.9,35.1
  Bottom 0.152: v80.9,35.1 80.9,12 84.4,8.5 87.3,8.5 88.27,9.46 J5.2
D0_FB  (via drill 0.35)
  Top 0.152: R22.2 85.5,44.8 79.4,38.7 v79.4,35.1
  Bottom 0.152: v79.4,35.1 79.4,12.7 84.2,7.9 87.58,7.9 J5.3
D0_V+
  Top 0.152: J5.1 84.19,12.69 84.13,12.76 84.13,18.5 85.06,19.42 85.12,19.42 85.29,19.59 85.29,20.5 87.5,22.72 88.16,22.72 88.75,23.3 88.75,24.14 89.16,24.55 Q4.3
D1_CONN  (via drill 0.35)
  Top 0.152: R18.2 60.3,46.9 56.5,43.1 v56.5,35.5
  Bottom 0.152: v56.5,35.5 56.5,11.5 59.6,8.4 62.4,8.4 62.87,8.87 J8.2
D1_FB  (via drill 0.35)
  Top 0.152: R23.2 60,49 54.9,43.9 v54.9,35.5
  Bottom 0.152: v54.9,35.5 54.9,12.3 59.3,7.9 62.8,7.9 64.14,9.23 J8.3
D1_V+
  Top 0.152: Q6.3 63.76,24.55 63.35,24.14 63.35,23.3 62.76,22.72 62.08,22.72 60.06,20.7 60.06,19.76 59.72,19.42 59.66,19.42 59.44,19.2 59.44,15.6 61.59,13.44 J8.1
D2_CONN  (via drill 0.35)
  Top 0.152: R19.2 36.9,51.1 30.7,44.9 v30.7,35.4
  Bottom 0.152: v30.7,35.4 30.7,11.2 33.2,8.7 36.46,8.7 37.47,9.7 J11.2
D2_FB  (via drill 0.35)
  Top 0.152: R24.2 36.7,53.2 29,45.5 v29,35.4
  Bottom 0.152: v29,35.4 29,11.8 32.6,8.2 37.09,8.2 J11.3
D2_V+
  Top 0.152: Q8.3 35.01,21.43 31.5,21.43 31.3,21.22 31.3,17.75 36.2,12.85 J11.1
D3_CONN
  Top 0.152: R20.2 8.63,55.3 5.29,51.96 5.29,17.91 9.4,13.8 9.4,9.7 10.3,8.8 11.66,8.8 12.06,9.2 J14.2
D3_FB
  Top 0.152: R25.2 10.3,57.4 4.9,52 4.9,17.8 9,13.7 9,9.6 10.2,8.4 11.88,8.4 J14.3
D3_V+
  Top 0.152: Q10.3 9.71,21.53 6.21,21.53 5.92,21.25 5.92,17.72 10.79,12.85 J14.1
DTR  (via drill 0.35)
  Top 0.152: v108.6,16.7 108.3,17 108.3,18.41 U3.23 | R14.1 115.95,27.2 v120.7,27.2 120.95,27.45 Q3.2
  Bottom 0.152: v120.7,27.2 113.75,27.2 108.6,22.05 v108.6,16.7
EN
  Top 0.152: R13.1 C11.1 113,31.8 114.42,33.22 Q2.3 113.2,36.12 113.2,42.7 112.4,43.5 105.41,43.5 104.91,44 104.91,59.37 104.39,59.88 U4.3
GND  (via drill 0.35)
  Top 0.152: U3.25 108.25,19.65 U3.2 | J1.S2 116.3,24.18 J1.B1/A12
  other vias: 8.7,51.5 17.5,51.4 8.7,44.6 17.5,45.2 8.7,38.8 17.5,38.3 8.7,33.1 15.3,33.4 8.7,28 13.4,28.6 6.6,10 5.9,15.1 2.45,4.6 10.1,6 15.5,6.2 16,10.7 18.1,11 18.1,23.2 16.6,26.7 18.9,31.3 16.7,29.8 2.45,21.9 2.45,32.2 2.45,44.5 2.45,54.8 2.45,60.3 7.27,60.3 12.1,60.3 21.74,60.3 26.57,60.3 31.39,60.3 36.22,60.3 29.8,52.3 27.7,48 27.4,40.3 33.9,38.6 42.55,38.6 34.5,43.3 42.55,43.4 42.55,48.7 33.1,48.4 29.8,41.6 42.55,52.15 42.55,54.25 34.1,54.25 52.9,54.25 56.9,54.25 63.5,54.25 69.3,54.25 52.9,52.15 57.1,52.15 63.7,52.15 69.4,52.15 68.8,50.05 63.7,50.05 57.6,50.05 52.9,49.3 52.9,45.6 52.9,42.2 52.9,38.6 52.9,35.2 60.1,35.6 59.7,39.9 59.8,43.9 68.6,44.4 64.3,44.2 68.4,39.8 68,36 77.4,35.2 77.6,45.6 77.8,41.9 77.7,38.5 80.4,42.6 81.1,45.7 84.6,45.7 88.2,45.7 91.9,45.7 77.9,47.95 80.8,47.95 68.4,47.95 64.3,47.95 59.9,47.95 57.3,45.2 55.7,40.8 66.1,31.3 64.3,31.3 60.8,31.2 52.9,30.9 52.9,28 52.9,23.6 52.9,18.1 52.9,14.2 40.7,9.7 39.5,3.5 37,3.7 27.9,4 30.7,3.9 28.9,9.6 26.9,14.2 27.1,20.7 27,24.6 27.3,29.3 27.5,32.3 26.9,35.6 34.3,32.4 37.2,32.4 41.3,32.5 38.7,30.2 34.8,30.3 34.3,27.3 37.3,27.9 42,28 39.6,27.2 38.8,21.4 42.2,21.3 44,23.5 39.2,18.3 41.1,17.6 44.2,14 44,10.4 31.9,14.7 33.2,12.8 34.3,10.7 45.86,60.3 55.51,60.3 60.33,60.3 65.16,60.3 74.81,60.3 79.63,60.3 84.45,60.3 89.28,60.3 94.1,60.3 78.2,50.05 81.7,50.05 86.4,50.05 89.9,50.05 93.7,50.05 78.3,52.15 81.6,52.15 86,52.15 89.9,52.15 94,52.15 78.3,54.25 81.6,54.25 85.8,54.25 89.8,54.25 93.8,54.25 11.7,56.35 17.5,56.35 27.8,56.35 31.3,56.35 35.3,56.35 42.55,56.35 52.9,56.35 56.8,56.35 63,56.35 68.5,56.35 78,56.35 81.8,56.35 85.6,56.35 89.9,56.35 94.2,56.35 86.8,47.95 90.1,47.95 94.3,47.95 87.2,43.75 92.2,43.75 84,35.5 84.1,39.1 94.4,38.7 94.1,41.2 93.9,36 91.8,31 87.3,30.9 83.9,31.2 85.3,29.4 89.6,29.4 60.3,29.7 64.1,29.7 57.8,16.3 58.4,13.7 59.3,11.4 60.2,13.3 66.4,10.5 66.1,8.4 52.9,10.2 52.9,7.2 56.4,8.6 69.2,13 69.5,10.2 63.2,17.7 65.5,17.7 69.4,17.5 64.7,21.9 66.5,21.6 69.2,21.9 69.5,25.2 62.5,3.6 64.5,3.5 52.9,3.9 56.2,3.7 78.8,3.2 81.5,3.6 87.9,3.8 89.8,3.5 97.4,4.3 97.7,1.9 100.6,1.1 80.8,8.4 77.9,8.4 77.7,11.8 77.6,15.8 77.6,18.9 77.7,22.4 77.7,26.1 77.4,30.3 82.4,28.2 82.5,25.3 82.8,23.1 85.3,26.7 82.4,16.9 82.6,13.7 83.9,10.9 91.6,8.8 91.7,10.8 90.5,16.9 88.5,17.6 91.7,18.2 94.5,23.2 89.4,21.6 94.4,27.3 99.1,22.1 99.3,20.1 103.1,21.9 103.2,20.1 97.7,14 97.5,9.7 105.4,11.3 105.5,15.3 107.3,15.3 109.7,18.2 119.4,17.5 118.4,19.2 118.9,4.7 118.3,2.2 119.9,18.9 117.7,21.1 120.5,20.7 118.4,22.6 120.9,22.6 118.3,25.4 114.3,26.5 110.8,22.5 120.6,18 106.2,41.8 107.1,41.8 105.8,39.1 108.1,41.8 106.9,39.1 108,39.1 114.6,42.4 116.9,42.3 116.7,40.7 114.8,40.9 114.7,39.2 114.7,37 113.3,34.2 112,32.8 111.5,31.3 107.6,32.7 109,35.8 99,28.2 98.9,30.3 101.7,41.3 101.9,39.4 106.5,62.1 106.6,58.8 106.5,54.7 106.6,49.7 109.6,49.4 113.6,49.3 116.4,49.5 116.1,54.7 116,57.6 116.1,62.2 109.9,62 114,62.1 110.4,59 113.7,59.4 112.1,42.5 120.9,42 121.2,39.2 112.3,8.9 115.1,2 116.9,7.2 111.8,4.1 111.9,10.7 113.8,7 109.4,1 107.1,11.3 102.5,6.9 106.1,26.6 21.8,51.5 21.4,45.8 22.5,31.6 22.3,25.9 21.9,18.5 22.1,12.5 22,3.8 11.3,3.6 14.1,3.5 47.3,48.5 47.3,43.6 47.3,39.1 47.3,52.15 47.3,54.25 47.3,56.35 41.04,60.3 16.92,60.3 21.6,39.6 47.3,30.7 47.3,24.6 47.3,18 47.3,12.9 47.3,8.1 47.3,3.5 72.9,3.5 72.7,10.2 72.6,16 72.6,21.8 72.4,27.3 72.8,35.4 47.3,35.4 72.3,39.3 72.5,43.7 72.5,47.95 72.6,50.05 72.8,52.15 73,54.25 73.2,56.35 69.98,60.3
  pour Bottom: 0.6,0.6 121.7,0.6 121.7,63.3 0.6,63.3
  pour Top: 0.6,0.6 0.6,63.3 121.7,63.3 121.7,0.6
IO0
  Top 0.152: Q3.3 120,45.7 U4.25
N$3
  Top 0.152: Q1.S 113.15,14.16 R3.1 111.92,12.93 D4.C
N$4
  Top 0.152: R6.1 R5.1 102.3,4.05 R7.2 C3.1
N$7
  Top 0.152: J1.A5 117.16,19.15 118.22,18.1 118.22,13.53 R1.2
N$8
  Top 0.152: J1.B5 115.08,22.15 114.38,22.85 R2.2
N$9
  Top 0.152: R8.1 R9.2 110.35,26.27 109.59,27.03 108.34,27.03 108.12,26.81 108.12,23.49 108.25,23.36 U3.8
N$10
  Top 0.152: D5.A 87.05,18.49 88.13,19.57 | 88.13,19.57 J4.2 J4.1 | Q5.3 87.3,20.4 88.13,19.57
N$11
  Top 0.152: Q2.1 115.15,29.8 R14.2
N$12
  Top 0.152: Q3.1 119.05,29.9 R15.2
N$13
  Top 0.152: U3.9 107.75,22.76 107.18,23.32 106.59,23.32 106.16,23.75 R10.1
N$14
  Top 0.152: Q4.6 87.37,23.25 86.44,22.32 86.1,22.32 84.83,21.05 Q5.2 84.75,20.88 84.42,20.55 R28.1
N$15
  Top 0.152: J7.1 J7.2 | Q7.3 61.96,20.4 J7.1 | D6.A 61.75,18.59 J7.1
N$16
  Top 0.152: R31.1 59.01,20.55 Q7.2 59.78,20.9 62.13,23.25 Q6.6
N$17
  Top 0.152: Q9.3 36.56,20.4 J10.1 | D7.A 36.45,18.69 J10.1 | J10.1 J10.2
N$18
  Top 0.152: Q8.6 38.36,24.55 37.65,23.85 37.65,23.01 35.54,20.9 Q9.2 33.6,20.55 R34.1
N$19
  Top 0.152: Q11.3 11.16,20.4 J13.1 | D8.A 11.05,18.69 J13.1 | J13.1 J13.2
N$20
  Top 0.152: R37.1 8.21,20.55 Q11.2 10.14,20.9 12.25,23.01 12.25,23.85 12.96,24.55 Q10.6
POWER
  Top 0.152: U5.6 104.88,39.44 105.3,39.85 105.3,42.91 104.6,43.61 104.6,48.91 103.8,49.71 U4.11
RTS  (via drill 0.35)
  Top 0.152: v105.7,16.7 105.7,17.91 U3.19 | Q2.2 117.1,31.13 v117.1,27.9 117.25,28.05 R15.1
  Bottom 0.152: v105.7,16.7 107.6,16.7 108.1,17.2 108.1,22.2 113.8,27.9 v117.1,27.9
RXD  (via drill 0.35)
  Top 0.152: U3.20 106.75,17.75 v106.4,17.4 | R11.2 116.9,35.1 v117.4,34.6
  Bottom 0.152: v106.4,17.4 106.4,21.63 117.4,32.63 v117.4,34.6
RXD0
  Top 0.152: U4.34 119.46,57.33 118.87,56.74 118.87,37.58 R12.1
SEL0
  Top 0.152: U5.2 103.42,42.03 101.57,43.88 101.57,51.22 102.6,52.25 U4.9
SEL1
  Top 0.152: U5.3 103.42,41.38 101.26,43.54 101.26,52.19 102.6,53.52 103.1,53.52 U4.8
SENSOR_CONN
  Top 0.152: U4.6 102.58,56.04 100.34,58.28 99.16,58.28 98.92,58.05 98.92,56.76 99.75,55.93 R20.1 99.75,54.67 98.92,53.84 98.92,52.55 99.75,51.73 R19.1 99.75,50.47 98.92,49.65 98.92,48.35 99.75,47.53 R18.1 99.75,46.27 98.92,45.45 98.92,44.16 99.75,43.33 R17.1 99.75,42.07 98.92,41.24 98.92,39.95 99.75,39.13 R16.2
SENSOR_FB
  Top 0.152: R21.2 99.75,41.23 100.58,42.05 100.58,43.34 99.75,44.17 R22.1 99.75,45.43 100.58,46.26 100.58,47.55 99.75,48.37 R23.1 99.75,49.63 100.58,50.45 100.58,51.74 99.75,52.57 R24.1 | R24.1 99.75,53.83 100.58,54.66 100.58,55.95 99.75,56.77 R25.1 | R24.1 101.34,54.79 U4.7
TXD  (via drill 0.35)
  Top 0.152: U3.21 107.25,17.65 v107.4,17.5 | R12.2 119,35.1 v118.5,34.6
  Bottom 0.152: v107.4,17.5 107.4,22.2 118.5,33.3 v118.5,34.6
TXD0
  Top 0.152: R11.1 116.9,37.4 118.47,38.97 118.47,57.97 119.1,58.6 U4.35
USB_D+  (via drill 0.35)
  Top 0.152: U3.3 111.6,20.15 | 111.6,20.15 112.45,20.15 | 112.45,20.15 J1.A6 | D2.2 111.6,20.15 | v113.1,19.5 112.45,20.15 | v113.1,21.4 113.71,22.01 114.42,22.01 114.86,21.57 114.86,21.4 115.11,21.15 J1.B6
  Bottom 0.152: v113.1,21.4 v113.1,19.5
USB_D-  (via drill 0.35)
  Top 0.152: U3.4 111.6,20.65 | 111.6,20.65 113.55,20.65 | 113.55,20.65 J1.A7 | v114.2,21.3 113.55,20.65 | D3.2 111.6,20.65 | J1.B7 114.75,19.65 v114.2,19.1
  Bottom 0.152: v114.2,21.3 v114.2,19.1
VALVE
  Top 0.152: U4.10 102.6,50.98 101.87,50.26 101.87,44.96 U5.1
VBUS  (via drill 0.35)
  Top 0.152: v113,18.3 113.32,17.98 | 113.32,17.98 110.62,17.98 109.46,16.82 D4.A | R8.2 111.7,23.75 v111.7,23 112.4,23 113.1,23.7 114.39,23.7 114.87,23.22 114.87,22.89 115.06,22.7 115.62,22.7 J1.B4/A9 | J1.A4/B9 115.71,17.98 D1.2 113.32,17.98
  Bottom 0.152: v111.7,23 111.7,19.6 v113,18.3